# EAGLE design ColorDetector (EAGLE 7.3.0)
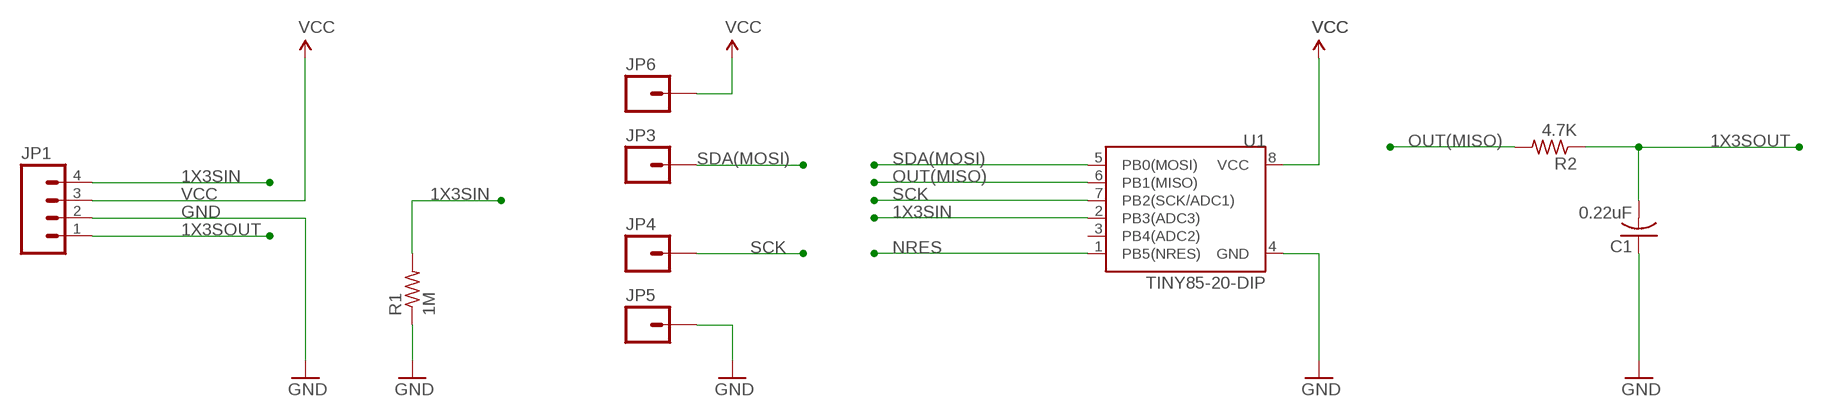
[diagram p0: schematic, sheet 1]

## Parts
C1  0.22uF  C-USC0402  [C0402]
JP1  M04PTH  [1X04]
JP3  M01PTH  [1X01]
JP4  M01PTH  [1X01]
JP5  M01PTH  [1X01]
JP6  M01PTH  [1X01]
R1  1M  R-US_R0603  [R0603]
R2  4.7K  R-US_R0603  [R0603]
U1  TINY85-20-DIP  ATTINY45TINY85-20-DIP  [DIP08]

## Nets
1X3SIN: JP1.4 R1.2 U1.2(PB3(ADC3))
1X3SOUT: C1.2 JP1.1 R2.1
GND: C1.1 JP1.2 JP5.1 R1.1 U1.4(GND)
NRES: U1.1(PB5(NRES))
OUT(MISO): R2.2 U1.6(PB1(MISO))
SCK: JP4.1 U1.7(PB2(SCK/ADC1))
SDA(MOSI): JP3.1 U1.5(PB0(MOSI))
VCC: JP1.3 JP6.1 U1.8(VCC)
Unconnected: U1.3(PB4(ADC2))

## Library data of the parts
C1 = adafruit:C-US: CAPACITOR, American symbol
JP1 = SparkFun-Connectors:M04: Header 4 Standard 4-pin 0.1" header. Use with straight break away headers (SKU : PRT-00116), right angle break away headers (PRT-00553), swiss pins (PRT-00743), machine pins (PRT-00117), and female headers (PRT-00115). Molex polarized connector foot print use with SKU : PRT-08231 with associated crimp pins and housings. 1MM SMD Version SKU: PRT-10208
JP3-JP6 = SparkFun-Connectors:M01: Header 1 Standard 1-pin 0.1" header. Use with straight break away headers (SKU : PRT-00116), right angle break away headers (PRT-00553), swiss pins (PRT-00743), machine pins (PRT-00117), and female headers (PRT-00115).
R1 R2 = adafruit:R-US_: RESISTOR, American symbol
U1 = SparkFun-DigitalIC:ATTINY45: Atmel 8-pin 2/4/8kB flash uC; PROD_ID: IC-09445

## Board
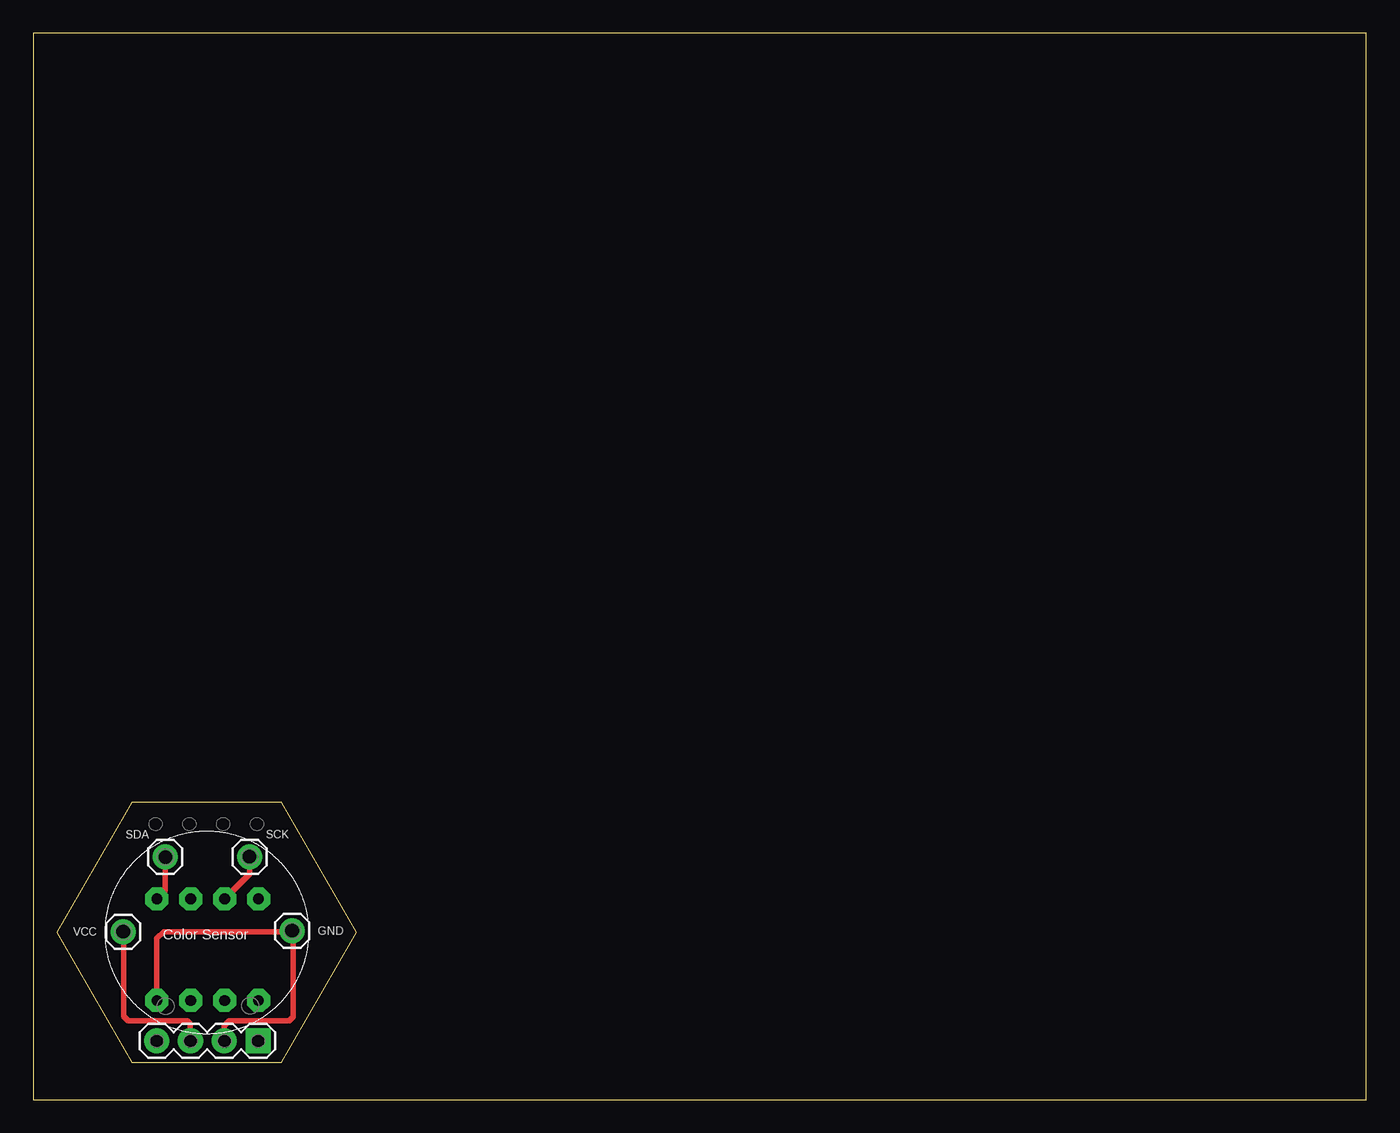
[diagram p1: board, top side]
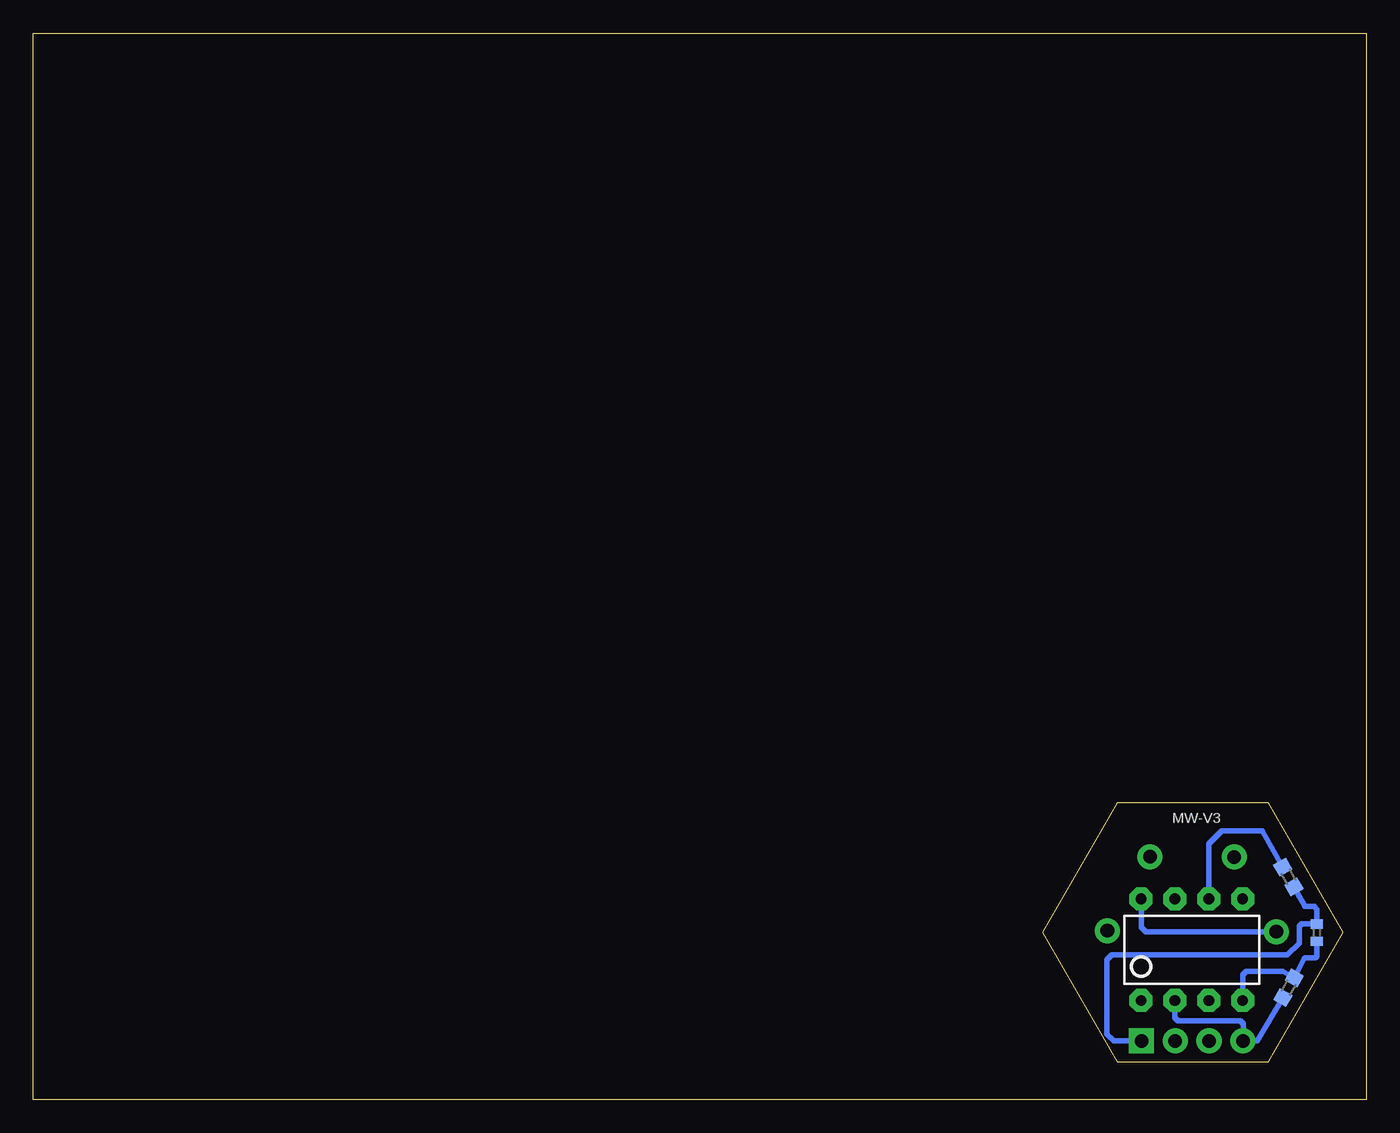
[diagram p2: board, bottom side, seen from below]

Size 100 x 80 mm. Coordinates in mm from the lower left corner, seen from the top.
Outline: 0,0 100,0 100,80 0,80 0,0
Outline: 7.39,2.79 18.64,2.79 24.27,12.53 18.64,22.27 7.39,22.27 1.77,12.53 7.39,2.79
Copper layers (1*16): Top 0.035mm / dielectric 1.5mm / Bottom 0.035mm
Design rules "default": minimum track width 10mil, minimum drill 24mil, track to track 8mil, track to pad 8mil, pad to pad 8mil, via to via 8mil, smd to smd 8mil, copper to edge 40mil, drill to drill 8mil, minimum pad ring 10mil, minimum via ring 8mil, stop-mask expansion 4mil, vias tented up to drill 0mil, thermal gap 10mil

### Footprints (pad centres in the part's own frame; a part is rotated, then mirrored left to right if it is on the bottom)
C0402 = smd 0.7 x 0.9: 1 -0.65,0; 2 0.65,0
1X04 = drill 1.016 pad 1.88 square: 1 0,0 | drill 1.016 pad 1.88: 2 2.54,0; 3 5.08,0; 4 7.62,0
1X01 = drill 1.016 pad 1.88: 1 0,0
R0603 = smd 1 x 1.1: 1 -0.85,0; 2 0.85,0
DIP08 = drill 0.813 pad 1.727 octagon: 1 -3.81,-3.81; 2 -1.27,-3.81; 3 1.27,-3.81; 4 3.81,-3.81; 5 3.81,3.81; 6 1.27,3.81; 7 -1.27,3.81; 8 -3.81,3.81

### Placement (x,y rotation side)
C1  3.7,12.52 90 bottom
JP1  16.87,4.39 180 top
JP3  9.91,18.2 0 top
JP4  16.22,18.21 0 top
JP5  19.42,12.66 0 top
JP6  6.74,12.59 0 top
R1  5.82,8.38 240 bottom
R2  5.84,16.7 120 bottom
U1  13.08,11.24 0 bottom

### Tracks (layer width: path | path; a pad name or v marks a point on that pad's centre or on a via)
1X3SIN
  Bottom 0.406: R1.2 8.18,4.41 JP1.4 9.22,4.42 9.22,5.66 9.46,5.91 14.12,5.91 14.35,6.13 U1.2
1X3SOUT
  Bottom 0.406: R2.1 4.62,14.53 4.6,14.5 3.91,14.5 3.7,14.29 C1.2 4.84,13.17 5.03,12.98 5.03,11.72 5.91,10.85 19.06,10.85 19.44,10.46 19.44,4.9 18.94,4.39 JP1.1
GND
  Top 0.406: U1.4 9.27,12.09 9.77,12.59 19.34,12.59 JP5.1 19.48,12.6 19.48,6.21 19.18,5.91 14.71,5.91 14.33,5.52 JP1.2
  Bottom 0.406: C1.1 3.7,10.76 3.82,10.63 4.58,10.63 4.64,10.58 R1.1 6.26,9.63 9,9.63 9.27,9.36 U1.4
OUT(MISO)
  Bottom 0.406: U1.6 11.81,19.18 10.83,20.16 7.81,20.16 R2.2
SCK
  Top 0.406: JP4.1 16.22,16.92 U1.7
SDA(MOSI)
  Top 0.406: JP3.1 9.91,15.68 U1.5
VCC
  Top 0.406: JP1.3 11.79,5.68 11.56,5.91 7.12,5.91 6.77,6.26 6.77,12.56 JP6.1
  Bottom 0.406: JP6.1 16.55,12.59 16.88,12.92 16.88,15.04 U1.8

### Text on the board
tPlace: SDA | SCK | VCC | Color Sensor | GND
bPlace: MW-V3